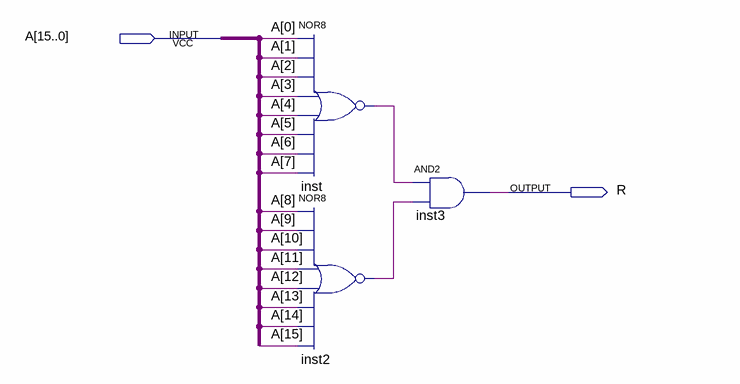
[diagram p0: schematic sheet]
// Quartus schematic nor16_bus.bdf as structural Verilog: 3 symbols, 2 pins
module nor16_bus (
  input  [15:0] A,
  output R
);

  wire inst2_out, inst_out;

  nor inst (inst_out, A[0], A[1], A[2], A[3], A[4], A[5], A[6], A[7]);
  nor inst2 (inst2_out, A[8], A[9], A[10], A[11], A[12], A[13], A[14], A[15]);
  and inst3 (R, inst_out, inst2_out);
endmodule
